# Altium schematic sheet RcMPPT-Top.SchDoc: RcMPPT-Top BMS
size A4; Author: Thomas Hofmann; CompanyName: HTL St. Pölten; Address2: Frenchs Forest; Address3: NSW; Address4: Australia 2086; DocumentNumber: 0; Revision: 2.0; SheetNumber: 1; SheetTotal: 5
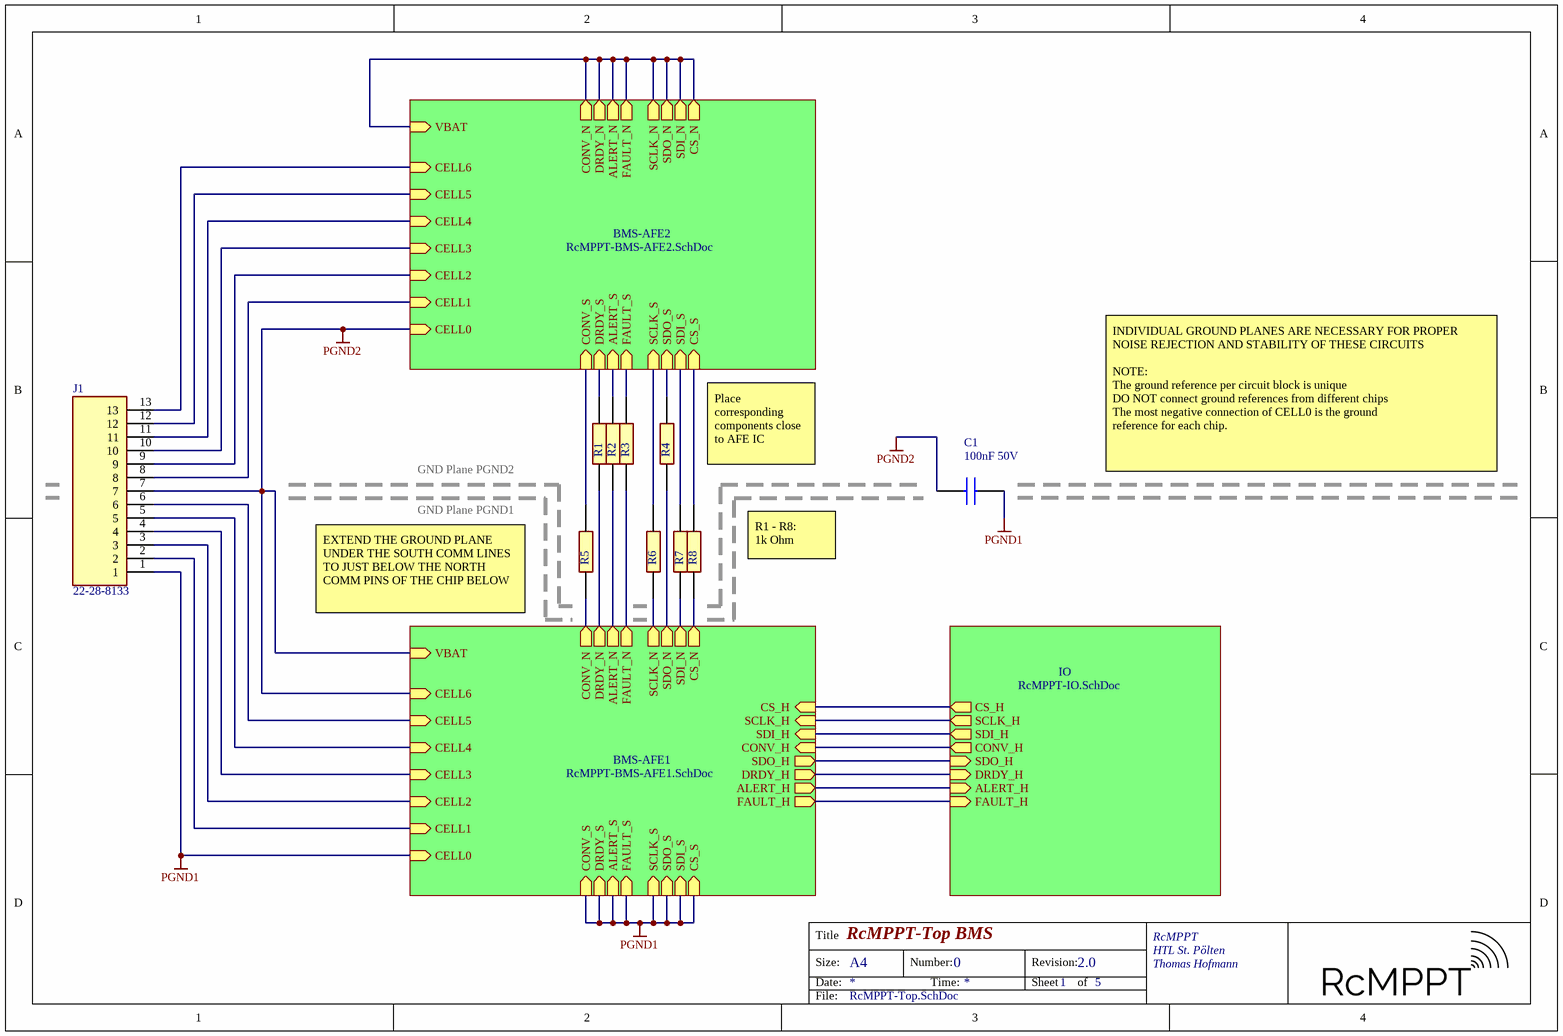
[diagram p0: RcMPPT-Top.SchDoc]

## Parts
C1  100nF 50V  [CAPC1608X97N]
J1  22-28-8133  [HDRRA13W66P0X254_1X13_3302X229X249P]
R1  1k  [RESC1005X40N]  (value not drawn)
R2  1k  [RESC1005X40N]  (value not drawn)
R3  1k  [RESC1005X40N]  (value not drawn)
R4  1k  [RESC1005X40N]  (value not drawn)
R5  1k  [RESC1005X40N]  (value not drawn)
R6  1k  [RESC1005X40N]  (value not drawn)
R7  1k  [RESC1005X40N]  (value not drawn)
R8  1k  [RESC1005X40N]  (value not drawn)

## Sub-sheets
BMS-AFE1 = RcMPPT-BMS-AFE1.SchDoc: CONV_N (out), DRDY_N (out), ALERT_N (out), FAULT_N (out), SCLK_N (out), SDO_N (out), SDI_N (out), CS_N (out), CONV_S (in), DRDY_S (in), ALERT_S (in), FAULT_S (in), SCLK_S (in), SDO_S (in), SDI_S (in), CS_S (in), VBAT (in), CELL0 (in), CELL1 (in), CELL2 (in), CELL3 (in), CELL4 (in), CELL5 (in), CELL6 (in), CS_H (in), SCLK_H (in), SDI_H (in), CONV_H (in), SDO_H (out), DRDY_H (out), ALERT_H (out), FAULT_H (out)
BMS-AFE2 = RcMPPT-BMS-AFE2.SchDoc: CONV_N (out), DRDY_N (out), ALERT_N (out), FAULT_N (out), SCLK_N (out), SDO_N (out), SDI_N (out), CS_N (out), CONV_S (in), DRDY_S (in), ALERT_S (in), FAULT_S (in), SCLK_S (in), SDO_S (in), SDI_S (in), CS_S (in), VBAT (in), CELL0 (in), CELL1 (in), CELL2 (in), CELL3 (in), CELL4 (in), CELL5 (in), CELL6 (in)
IO = RcMPPT-IO.SchDoc: CS_H (out), SCLK_H (out), SDI_H (out), CONV_H (out), SDO_H (in), DRDY_H (in), ALERT_H (in), FAULT_H (in)

## Nets
PGND1: C1.1 J1.1 ; sheet BMS-AFE1/CONV_S, sheet BMS-AFE1/DRDY_S, sheet BMS-AFE1/ALERT_S, sheet BMS-AFE1/FAULT_S, sheet BMS-AFE1/SCLK_S, sheet BMS-AFE1/SDO_S, sheet BMS-AFE1/SDI_S, sheet BMS-AFE1/CS_S, sheet BMS-AFE1/CELL0
PGND2: C1.2 J1.7 ; sheet BMS-AFE1/VBAT, sheet BMS-AFE1/CELL6, sheet BMS-AFE2/CELL0
NetJ1_2: J1.2 ; sheet BMS-AFE1/CELL1
NetJ1_3: J1.3 ; sheet BMS-AFE1/CELL2
NetJ1_4: J1.4 ; sheet BMS-AFE1/CELL3
NetJ1_5: J1.5 ; sheet BMS-AFE1/CELL4
NetJ1_6: J1.6 ; sheet BMS-AFE1/CELL5
NetJ1_8: J1.8 ; sheet BMS-AFE2/CELL1
NetJ1_9: J1.9 ; sheet BMS-AFE2/CELL2
NetJ1_10: J1.10 ; sheet BMS-AFE2/CELL3
NetJ1_11: J1.11 ; sheet BMS-AFE2/CELL4
NetJ1_12: J1.12 ; sheet BMS-AFE2/CELL5
NetJ1_13: J1.13 ; sheet BMS-AFE2/CELL6
NetR1_1: R1.1 ; sheet BMS-AFE1/DRDY_N
NetR1_2: R1.2 ; sheet BMS-AFE2/DRDY_S
NetR2_1: R2.1 ; sheet BMS-AFE1/ALERT_N
NetR2_2: R2.2 ; sheet BMS-AFE2/ALERT_S
NetR3_1: R3.1 ; sheet BMS-AFE1/FAULT_N
NetR3_2: R3.2 ; sheet BMS-AFE2/FAULT_S
NetR4_1: R4.1 ; sheet BMS-AFE1/SDO_N
NetR4_2: R4.2 ; sheet BMS-AFE2/SDO_S
NetR5_1: R5.1 ; sheet BMS-AFE1/CONV_N
NetR5_2: R5.2 ; sheet BMS-AFE2/CONV_S
NetR6_1: R6.1 ; sheet BMS-AFE1/SCLK_N
NetR6_2: R6.2 ; sheet BMS-AFE2/SCLK_S
NetR7_1: R7.1 ; sheet BMS-AFE1/SDI_N
NetR7_2: R7.2 ; sheet BMS-AFE2/SDI_S
NetR8_1: R8.1 ; sheet BMS-AFE1/CS_N
NetR8_2: R8.2 ; sheet BMS-AFE2/CS_S
(unnamed): sheet IO/CS_H, sheet BMS-AFE1/CS_H
(unnamed): sheet IO/SCLK_H, sheet BMS-AFE1/SCLK_H
(unnamed): sheet IO/SDI_H, sheet BMS-AFE1/SDI_H
(unnamed): sheet IO/CONV_H, sheet BMS-AFE1/CONV_H
(unnamed): sheet IO/SDO_H, sheet BMS-AFE1/SDO_H
(unnamed): sheet IO/DRDY_H, sheet BMS-AFE1/DRDY_H
(unnamed): sheet IO/ALERT_H, sheet BMS-AFE1/ALERT_H
(unnamed): sheet IO/FAULT_H, sheet BMS-AFE1/FAULT_H
(unnamed): sheet BMS-AFE2/CONV_N, sheet BMS-AFE2/DRDY_N, sheet BMS-AFE2/ALERT_N, sheet BMS-AFE2/FAULT_N, sheet BMS-AFE2/SCLK_N, sheet BMS-AFE2/SDO_N, sheet BMS-AFE2/SDI_N, sheet BMS-AFE2/CS_N, sheet BMS-AFE2/VBAT

## Notes on the sheet
- GND Plane PGND2
- GND Plane PGND1
- (near R4) Place corresponding components close to AFE IC
- INDIVIDUAL GROUND PLANES ARE NECESSARY FOR PROPER
  NOISE REJECTION AND STABILITY OF THESE CIRCUITS
  NOTE:
  The ground reference per circuit block is unique
  DO NOT connect ground references from different chips
  The most negative connection of CELL0 is the ground
  reference for each chip.
- R1 - R8:
  1k Ohm
- EXTEND THE GROUND PLANE
  UNDER THE SOUTH COMM LINES
  TO JUST BELOW THE NORTH
  COMM PINS OF THE CHIP BELOW
- Title
- Size:
- Date:
- A4
- Number:
- Time:
- Revision:
- Sheet
- of
- RcMPPT
- File:

## Library data of the parts
C1 = C0603: Capacitor; Height: 0.97
J1 = 22-28-8133: Connector; Manufacturer_Name: Molex; Datasheet Link: https://www.molex.com/pdm_docs/sd/022288133_sd.pdf; Height: 2.49mm; Manufacturer_Part_Number: 22-28-8133; Mouser Part Number: 538-22-28-8133; Mouser Price/Stock: https://www.mouser.co.uk/ProductDetail/Molex/22-28-8133?qs=l%252BWx29wYPrwPQBTZUVDqKw%3D%3D
R1-R8 = R0402: Resistor; Height: 0.4mm